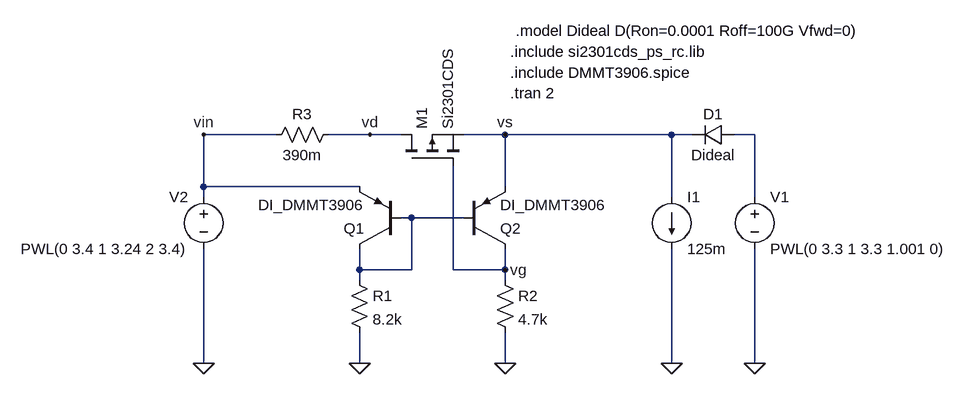
[diagram p0: schematic simulation.asc]
simulation.asc, the LTspice schematic file:
Version 4
SHEET 1 1036 680
WIRE -16 0 -128 0
WIRE 128 0 64 0
WIRE 176 0 128 0
WIRE 336 0 272 0
WIRE 592 0 336 0
WIRE 624 0 592 0
WIRE 720 0 688 0
WIRE -128 80 -128 0
WIRE 112 80 -128 80
WIRE 336 80 336 0
WIRE -128 96 -128 80
WIRE 592 96 592 0
WIRE 720 96 720 0
WIRE 192 128 176 128
WIRE 272 128 192 128
WIRE 112 208 112 176
WIRE 192 208 192 128
WIRE 192 208 112 208
WIRE 256 208 256 48
WIRE 336 208 336 176
WIRE 336 208 256 208
WIRE 112 224 112 208
WIRE 336 224 336 208
WIRE -128 352 -128 176
WIRE 112 352 112 304
WIRE 336 352 336 304
WIRE 592 352 592 176
WIRE 720 352 720 176
FLAG 112 352 0
FLAG 336 352 0
FLAG 592 352 0
FLAG -128 352 0
FLAG 336 208 vg
FLAG 336 0 vs
FLAG -128 0 vin
FLAG 720 352 0
FLAG 128 0 vd
SYMBOL pmos 176 48 R270
SYMATTR InstName M1
SYMATTR Value Si2301CDS
SYMATTR Prefix X
SYMBOL pnp 176 176 R180
SYMATTR InstName Q1
SYMATTR Value DI_DMMT3906
SYMBOL pnp 272 176 M180
SYMATTR InstName Q2
SYMATTR Value DI_DMMT3906
SYMBOL res 96 208 R0
SYMATTR InstName R1
SYMATTR Value 8.2k
SYMBOL res 320 208 R0
SYMATTR InstName R2
SYMATTR Value 4.7k
SYMBOL res -32 16 R270
WINDOW 0 32 56 VTop 2
WINDOW 3 0 56 VBottom 2
SYMATTR InstName R3
SYMATTR Value 390m
SYMBOL voltage -128 80 M0
WINDOW 123 0 0 Left 0
WINDOW 39 0 0 Left 0
SYMATTR InstName V2
SYMATTR Value PWL(0 3.4 1 3.24 2 3.4)
SYMBOL current 592 96 R0
SYMATTR InstName I1
SYMATTR Value 125m
SYMBOL voltage 720 80 R0
WINDOW 123 0 0 Left 0
WINDOW 39 0 0 Left 0
SYMATTR InstName V1
SYMATTR Value PWL(0 3.3 1 3.3 1.001 0)
SYMBOL diode 688 -16 R90
WINDOW 0 0 32 VBottom 2
WINDOW 3 32 32 VTop 2
SYMATTR InstName D1
SYMATTR Value Dideal
TEXT 344 -128 Left 2 !.include si2301cds_ps_rc.lib
TEXT 344 -64 Left 2 !.tran 2
TEXT 344 -96 Left 2 !.include DMMT3906.spice
TEXT 352 -160 Left 2 !.model Dideal D(Ron=0.0001 Roff=100G Vfwd=0)

The netlist it stands for:
* simulation.asc
XM1 vd vg vs Si2301CDS  ; pins D G S
Q1 N002 N002 vin 0 DI_DMMT3906
Q2 vg N002 vs 0 DI_DMMT3906
R1 N002 0 8.2k
R2 vg 0 4.7k
R3 vin vd 390m
V2 vin 0 PWL(0 3.4 1 3.24 2 3.4)
I1 vs 0 125m
V1 N001 0 PWL(0 3.3 1 3.3 1.001 0)
D1 N001 vs Dideal
.model D D
.lib standard.dio
.model NPN NPN
.model PNP PNP
.lib standard.bjt
.include si2301cds_ps_rc.lib
.tran 2
.include DMMT3906.spice
.model Dideal D(Ron=0.0001 Roff=100G Vfwd=0)
.backanno
.end